# EAGLE design SpringX (EAGLE 6.5.0)
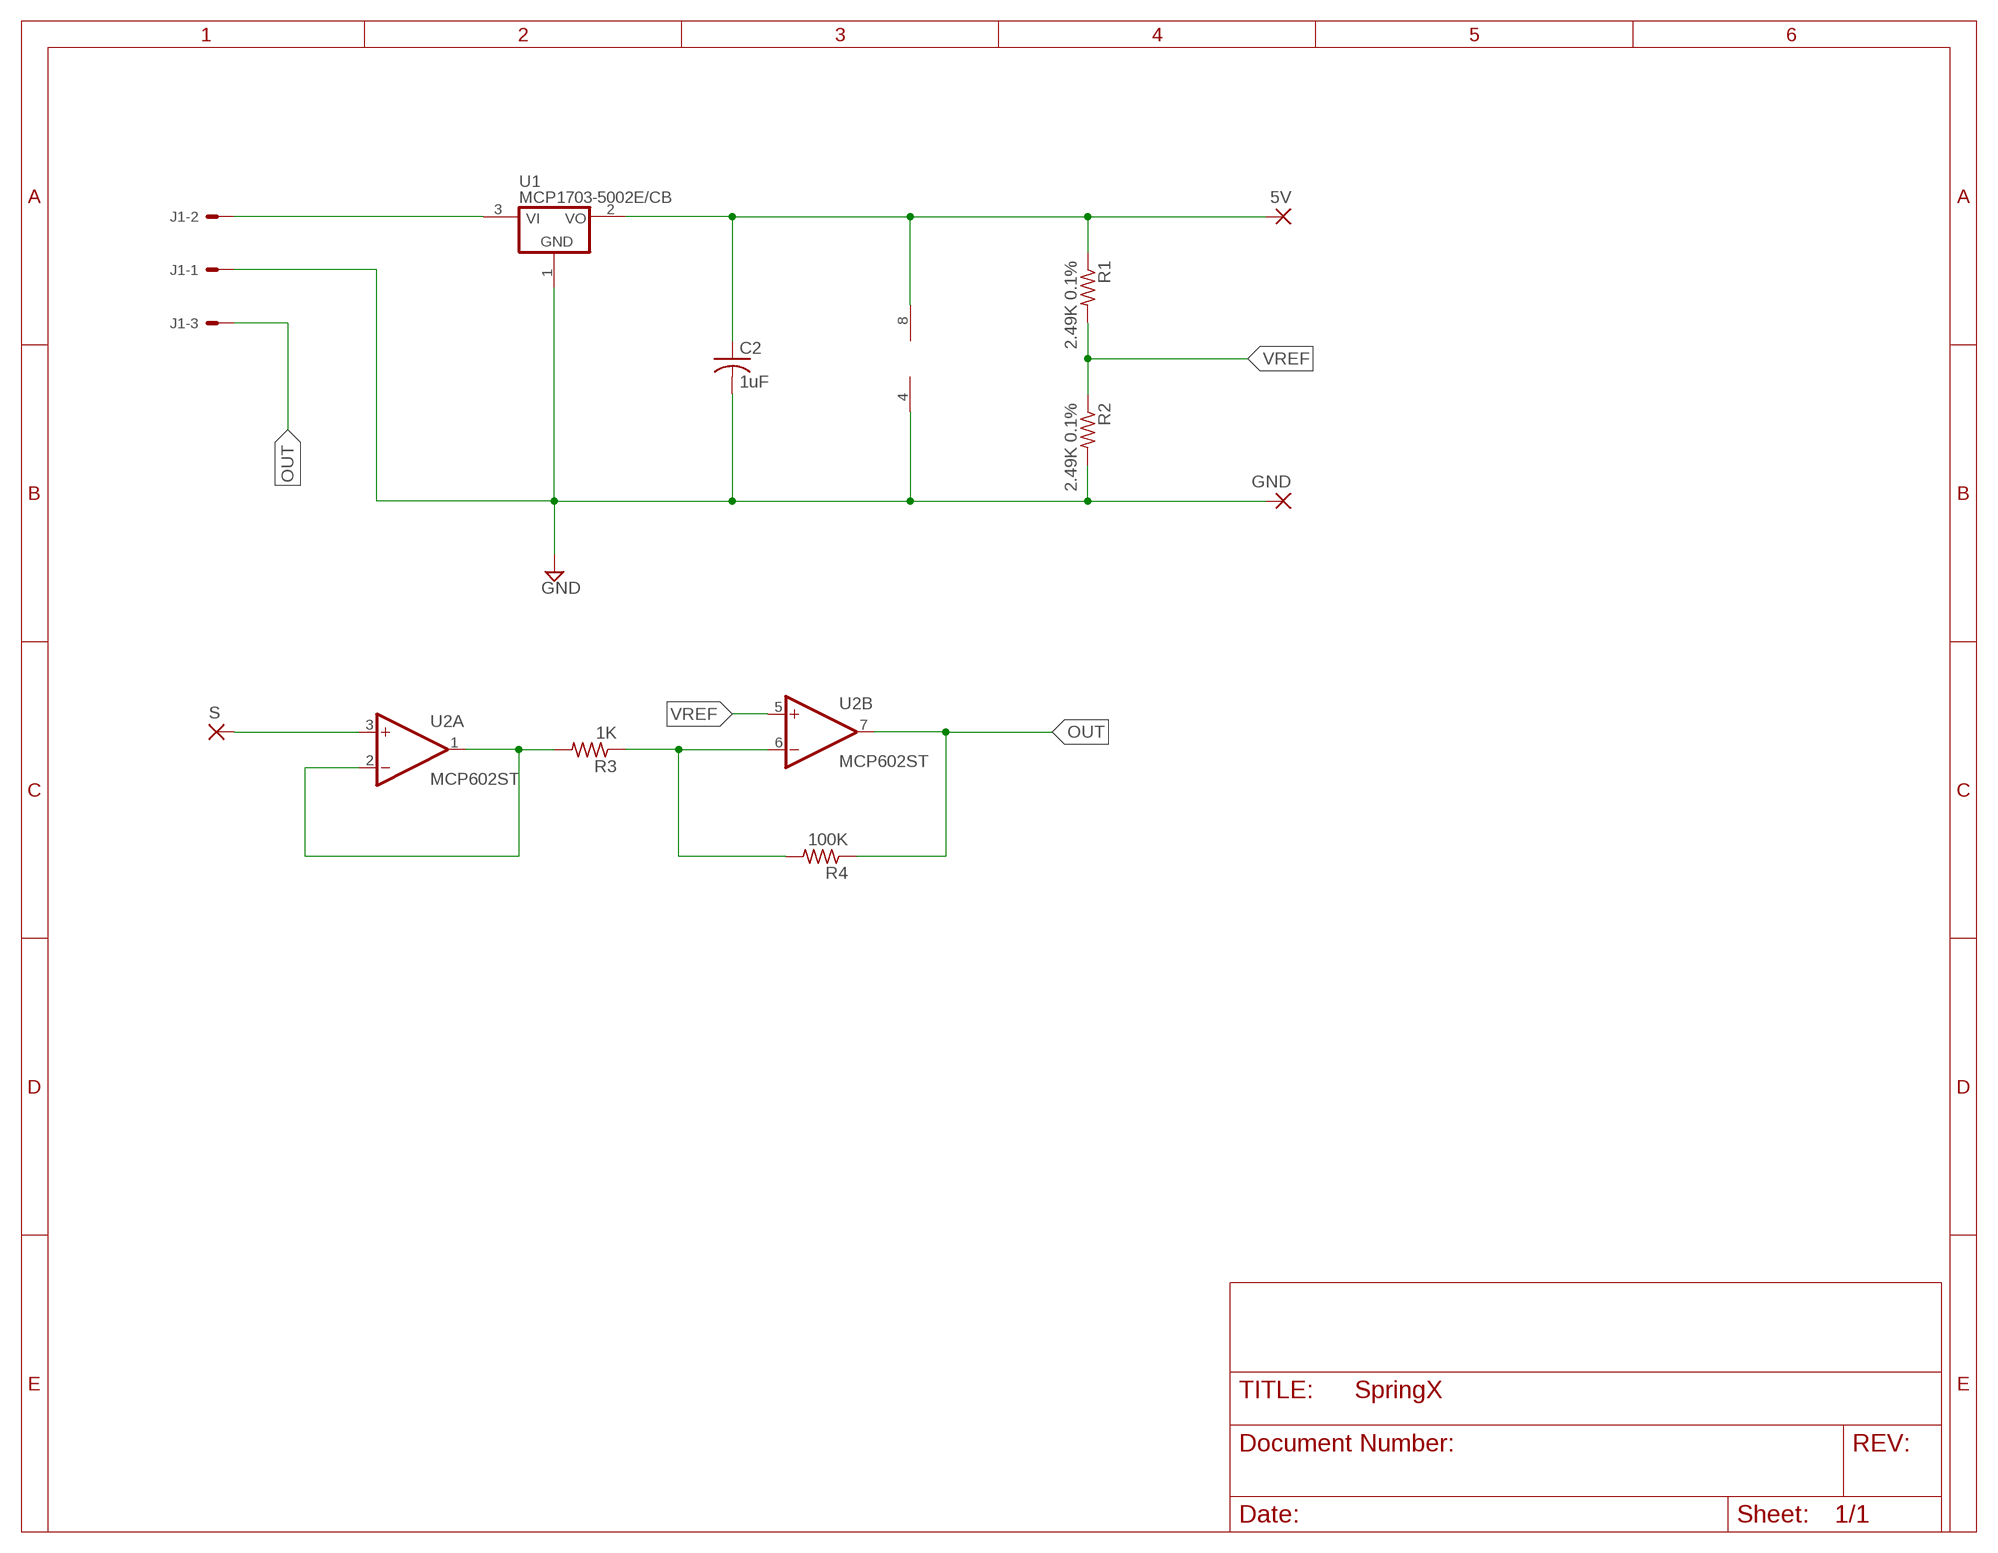
[diagram p0: schematic, sheet 1]

## Parts
5V  2,15/1,0  [2,15/1,0]
C2  1uF  C-USC0603  [C0603]
GND  2,15/1,0  [2,15/1,0]
J1  22-05-7038-03  [7395-03]
R1  2.49K 0.1%  R-US_R0603  [R0603]
R2  2.49K 0.1%  R-US_R0603  [R0603]
R3  1K  R-US_R0603  [R0603]
R4  100K  R-US_R0603  [R0603]
S  2,15/1,0  [2,15/1,0]
U1  MCP1703-5002E/CB  [SOT23A_MICROCHIP_CB]
U2  MCP602ST  [TSSOP8]

## Nets
5V: 5V.1(P) C2.1 R1.1 U1.2(VO) U2.8(P:V+)
GND: C2.2 GND.1(P) J1.1 R2.2 U1.1(GND) U2.4(P:V-)
N$2: R3.2 U2.1(A:OUT) U2.2(A:-IN)
N$3: S.1(P) U2.3(A:+IN)
N$4: R3.1 R4.2 U2.6(B:-IN)
OUT: J1.3 R4.1 U2.7(B:OUT)
VI: J1.2 U1.3(VI)
VREF: R1.2 R2.1 U2.5(B:+IN)

## Library data of the parts
5V GND S = wirepad:2,15/1,0: THROUGH-HOLE PAD
C2 = rcl:C-US: CAPACITOR, American symbol
J1 = ep_molex_6410_7395-02:22-?-03: CONNECTOR wire to board 2.54 mm (.1 inch) pitch header
R1-R4 = rcl:R-US_: RESISTOR, American symbol
U1 = _hhn_MCP1703:MCP1703*02E/CB: MCP1703[A] Series of Voltage Regulators – SOT23A (Microchip CB) (1.2 … 5.0)V, LDO, 16 V Input, 100/150/200/250 mA, Low Quiescent Current Source: http://ww1.microchip.com/downloads/en/DeviceDoc/22049f.pdf http://ww1.microchip.com/downloads/en/DeviceDoc/25122A.pdf Packages: SOT23, Microchip package identifier "CB" (dimensions and recommended land patterns acc. to Microchip) Technologies: MCP1703[A]T-xx02E/CB T : Tape and Reel xx: Output Voltage * 1000 mV; 12|15|18|25|28|30|33|40|50 0 : Extra Feature Code (fixed) 2 : Output volt. Tol.: ±2% (standard) E : Temperature range (−40…+125)°C CB: Package: SOT23A Author: Dipl.-Ing. FH Rainer Bayer HHN Hochschule Heilbronn, rainer.bayer@hs-heilbronn.de Ingenieurbüro ing-rb, mail@ing-rb.de
U2 = linear:MCP602: Single Op Amp 2.7V to 6.0V Single Supply CMOS Source: http://ww1.microchip.com/downloads/en/DeviceDoc/21314g.pdf

## Board
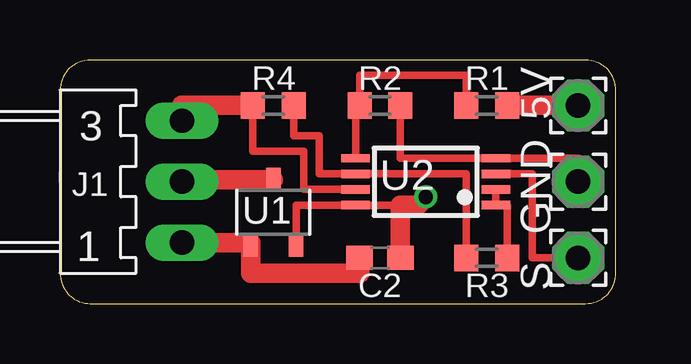
[diagram p1: board, top side]
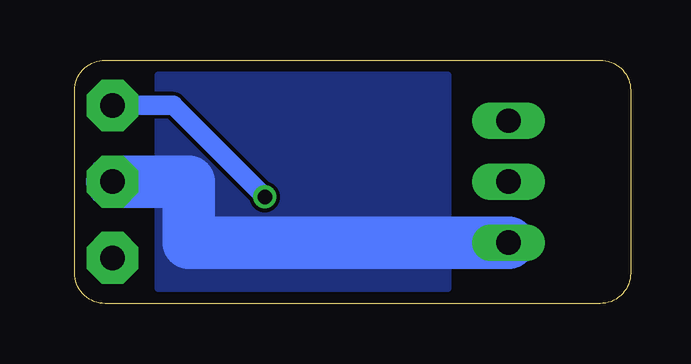
[diagram p2: board, bottom side, seen from below]

Size 23.16 x 10.15 mm. Coordinates in mm from the lower left corner, seen from the top.
Outline: 21.89,10.15 1.27,10.15 arc90 0,8.88 0,1.27 arc90 1.27,0 21.89,0 arc90 23.16,1.27 23.16,8.88 arc90 21.89,10.15
Copper layers (1*16): Top 0.0356mm / dielectric 1.5011mm / Bottom 0.0356mm
Design rules "LaenPCBOrder": minimum track width 6mil, minimum drill 13mil, track to track 6mil, track to pad 6mil, pad to pad 6mil, via to via 6mil, smd to smd 6mil, copper to edge 15mil, drill to drill 6mil, minimum pad ring 7mil, minimum via ring 7mil, stop-mask expansion 3mil, vias tented up to drill 0mil, thermal gap 10mil

### Footprints (pad centres in the part's own frame; a part is rotated, then mirrored left to right if it is on the bottom)
2,15/1,0 = drill 1.016 pad 2.159 octagon: 1 0,0
C0603 = smd 1.1 x 1: 1 -0.85,0; 2 0.85,0
7395-03 = drill 1.016 long: 1 2.54,0; 2 0,0; 3 -2.54,0
R0603 = smd 1 x 1.1: 1 -0.85,0; 2 0.85,0
SOT23A_MICROCHIP_CB = smd 0.6 x 1: 1 -0.95,-1.35; 2 0.95,-1.35; 3 0,1.35
TSSOP8 = smd 0.35 x 1.2: 1 -0.975,-2.925; 2 -0.325,-2.925; 3 0.325,-2.925; 4 0.975,-2.925; 5 0.975,2.925; 6 0.325,2.925; 7 -0.325,2.925; 8 -0.975,2.925

### Placement (x,y rotation side)
5V  21.59,8.26 270 top
C2  13.34,1.91 180 top
GND  21.59,5.08 270 top
J1  5.08,5.08 270 top
R1  17.78,8.26 180 top
R2  13.34,8.26 0 top
R3  17.78,1.91 0 top
R4  8.89,8.26 0 top
S  21.59,1.91 270 top
U1  8.89,3.81 0 top
U2  15.24,5.08 90 top

### Tracks (layer width: path | path; a pad name or v marks a point on that pad's centre or on a via)
5V  (via drill 0.6)
  Top 0.305: U1.2 9.84,4.11 U2.8 14.19,4.11
  Top 0.813: C2.1 14.19,4.11 14.9,4.11 v15.24,4.45 | 5V.1 R1.1
  Bottom 0.813: v15.24,4.45 19.05,8.26 5V.1
GND
  Top 0.305: R2.2 14.19,6.05 U2.4 21.59,6.05 GND.1
  Top 0.813: J1.1 7.94,2.54 U1.1 7.94,1.27 12.48,1.27 C2.2
  Bottom 2.184: J1.1 18.41,2.54 18.41,5.08 GND.1
  pour Bottom: 7.62,9.53 19.68,9.53 19.68,0.64 7.62,0.64
N$2
  Top 0.305: U2.2 U2.1 18.63,4.11 R3.2
N$3
  Top 0.305: S.1 19.68,1.91 19.68,5.41 U2.3
N$4
  Top 0.305: R4.2 9.74,6.99 10.79,6.99 10.79,5.41 U2.6 16.93,5.41 R3.1
OUT
  Top 0.305: U2.7 10.16,4.75 10.16,6.35 8.04,6.35 R4.1
  Top 0.813: J1.3 5.08,8.26 R4.1
VI
  Top 0.813: J1.2 5.08,5.16 U1.3
VREF
  Top 0.305: U2.5 12.31,8.26 R2.1 12.48,9.53 16.93,9.53 R1.2